# EAGLE design OpIoT_jetson_v_1_5 (EAGLE 9.6.2)
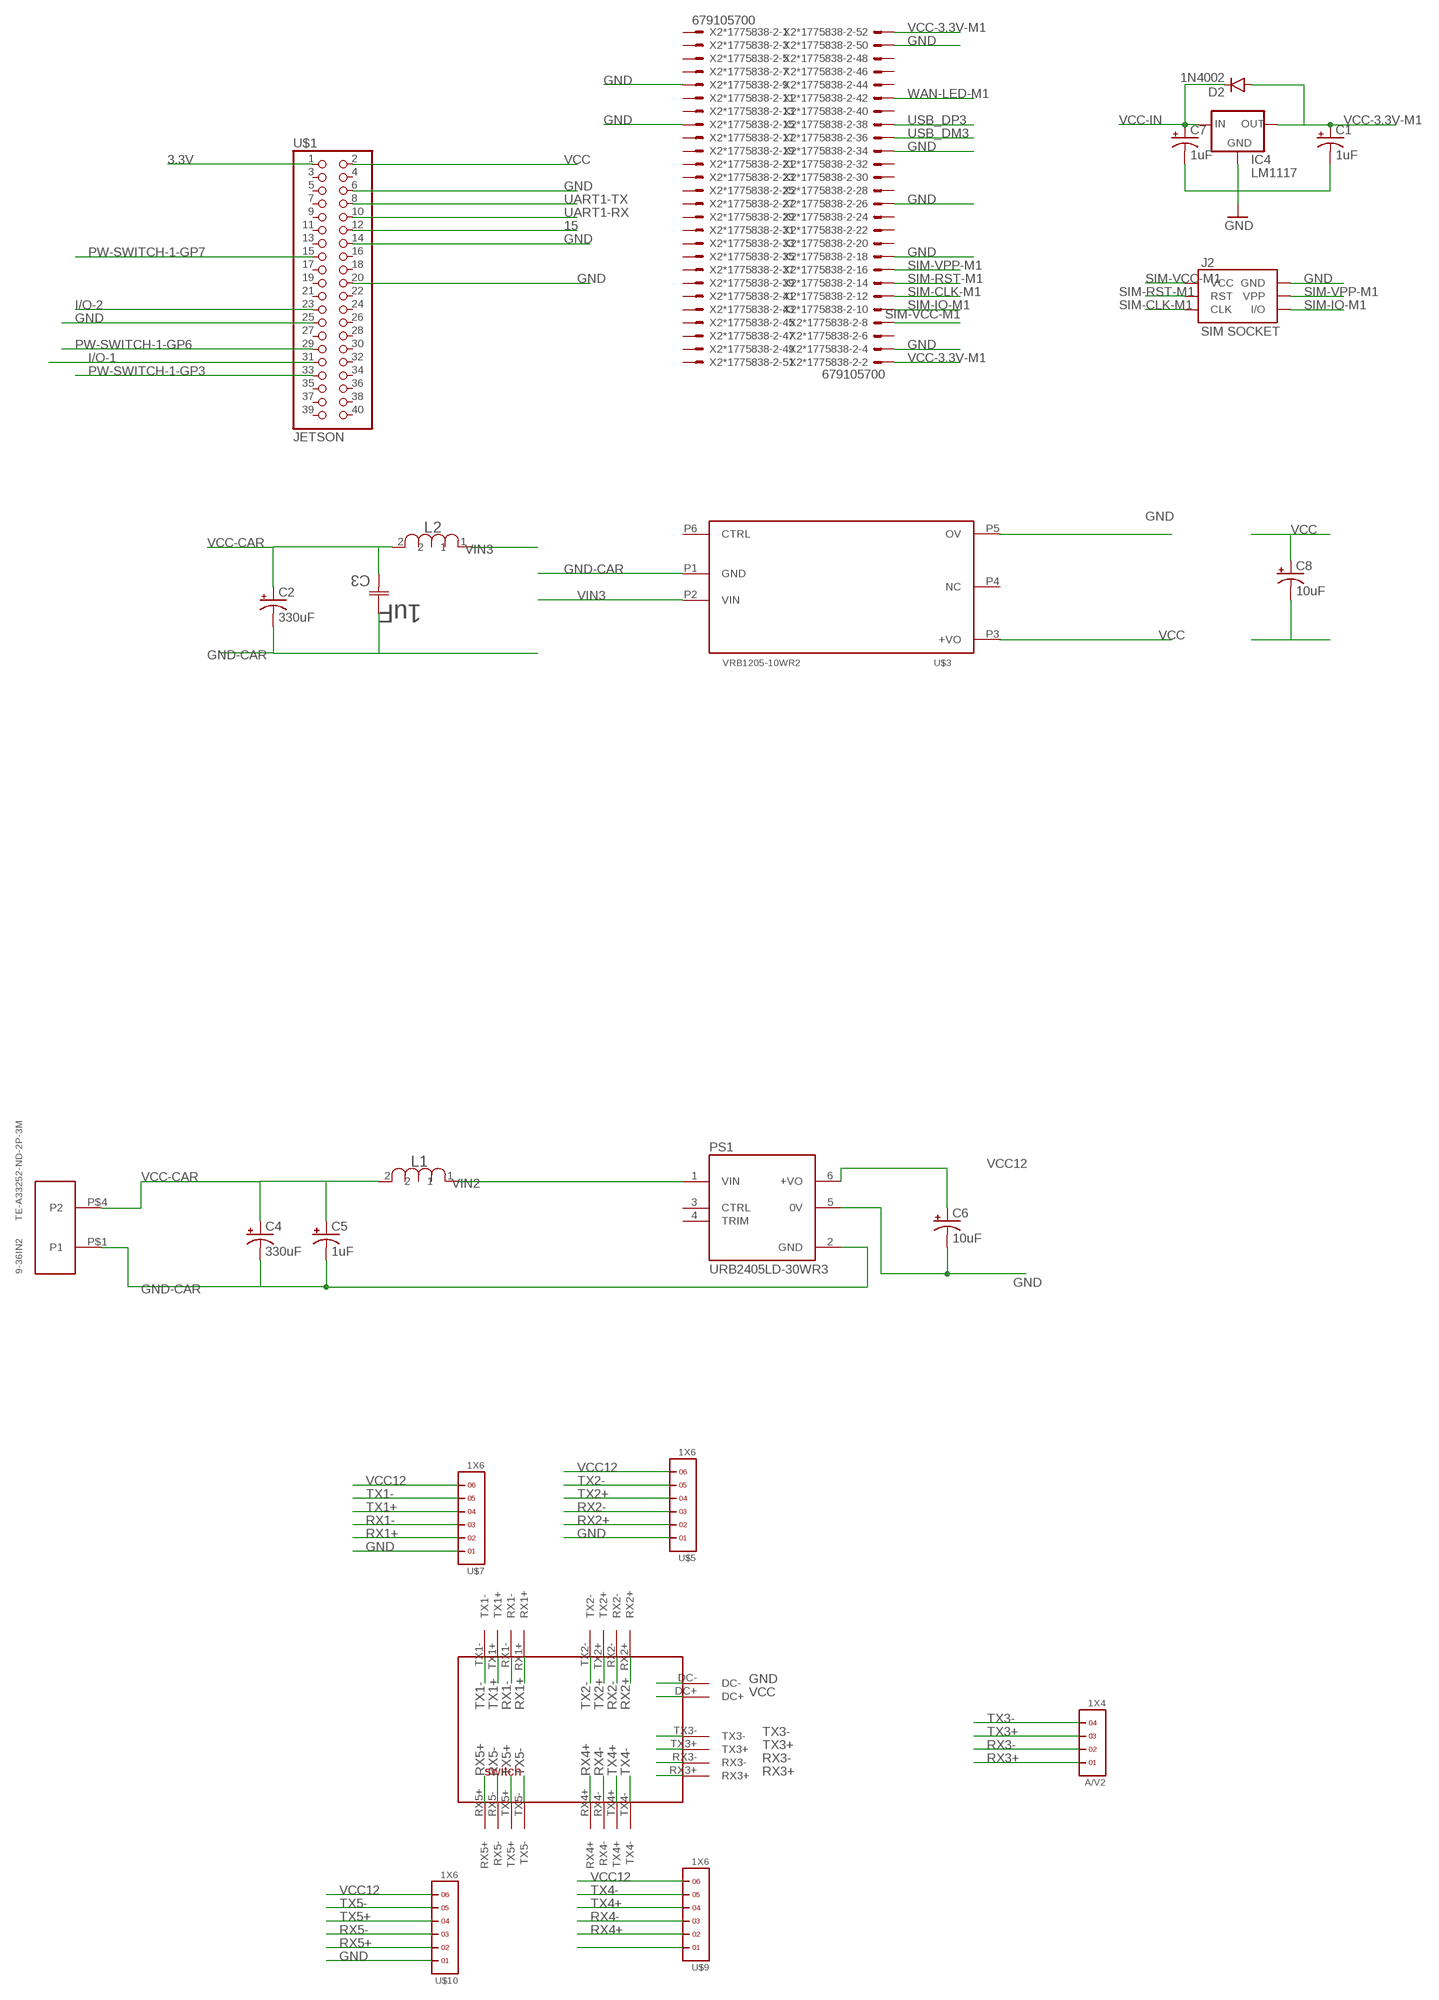
[diagram p0: schematic, sheet 1, part 1 of 3]
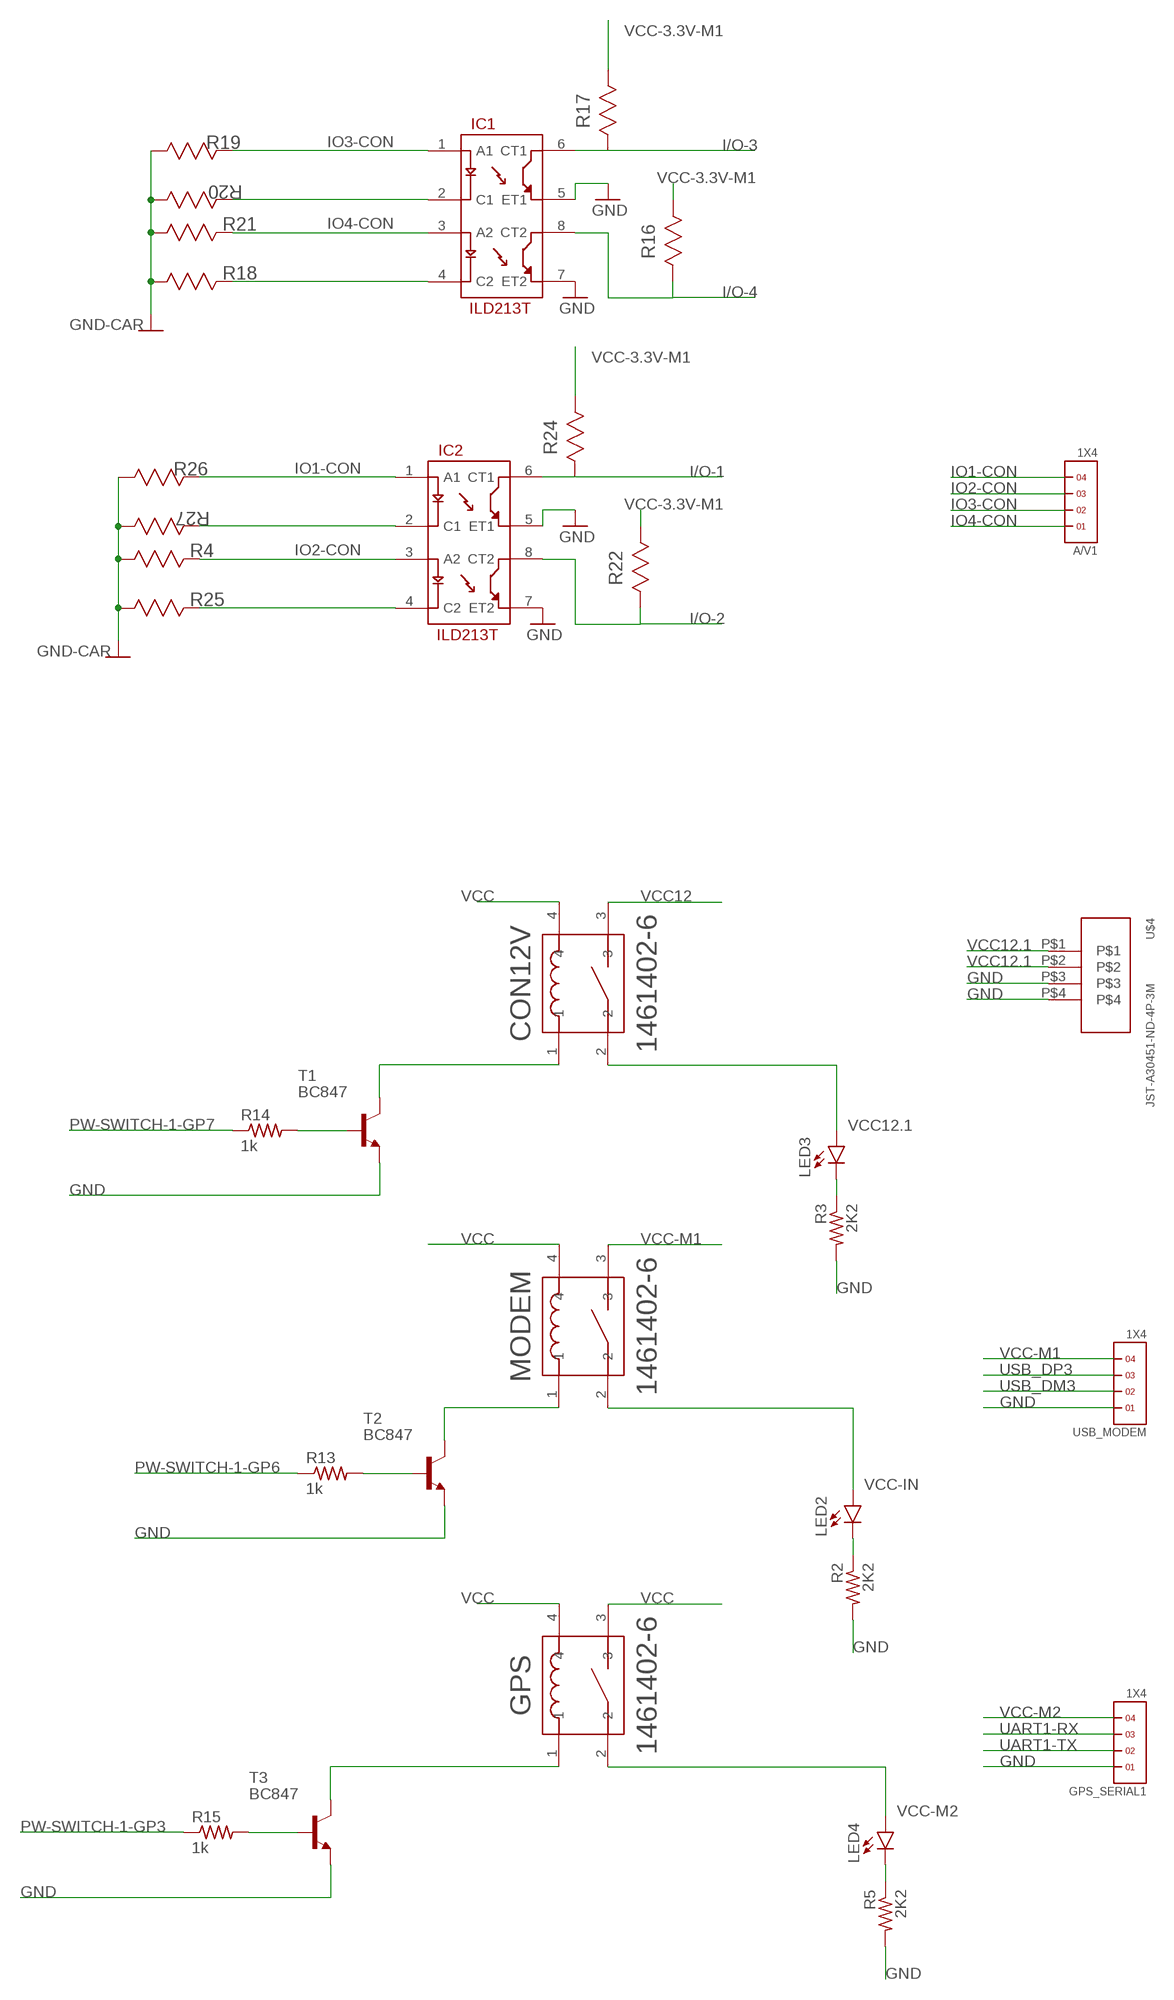
[diagram p1: schematic, sheet 1, part 2 of 3]
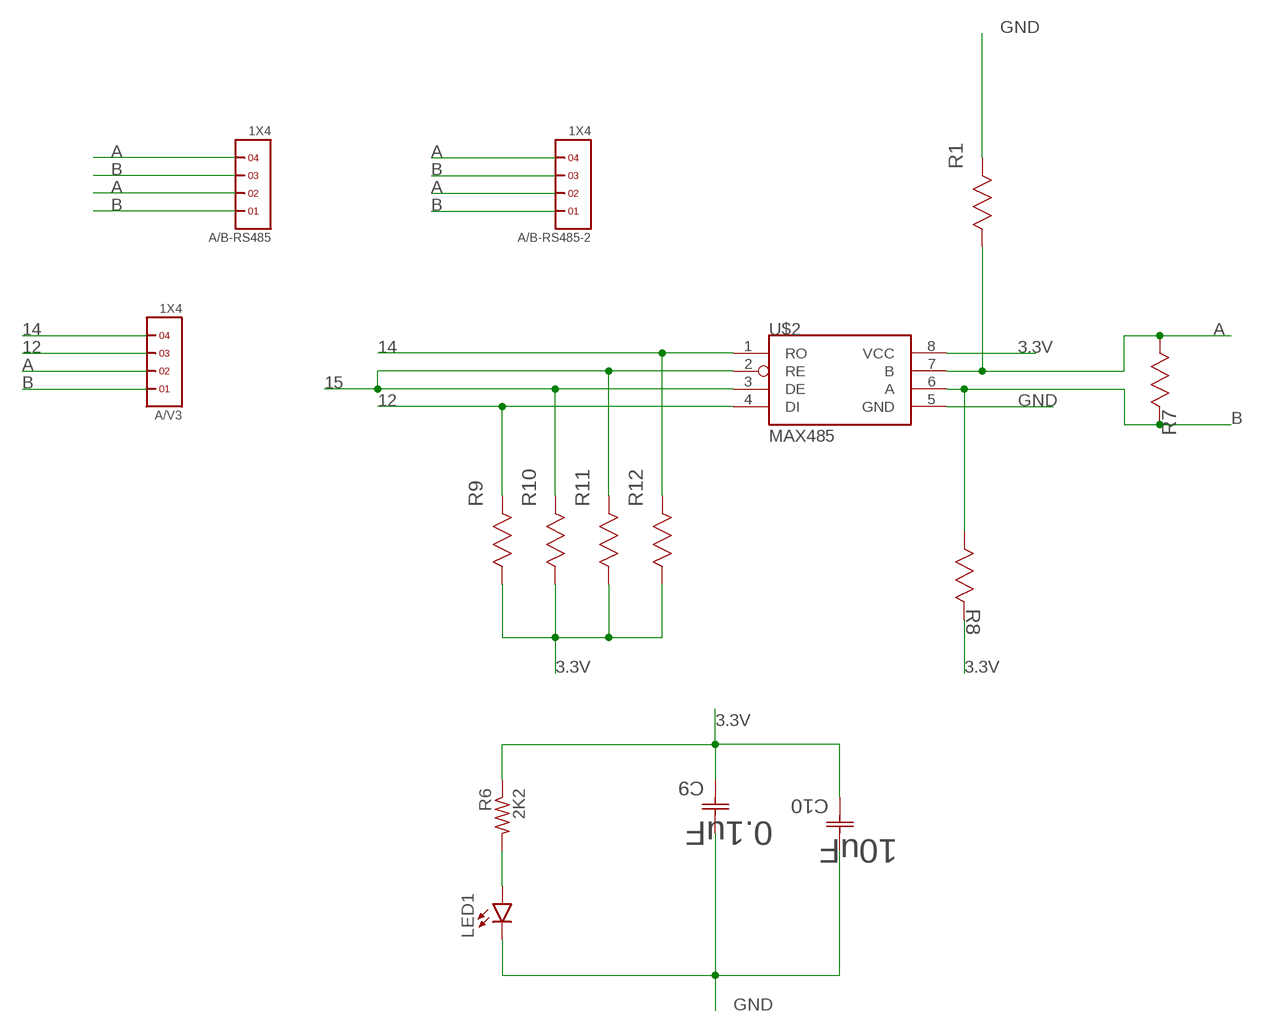
[diagram p2: schematic, sheet 1, part 3 of 3]

## Parts
9-36IN2  TE-A33252-ND-2P-3M  [TE-A33252-ND-2P-3M]
A/B-RS485  1X4  [1X4]
A/B-RS485-2  1X4  [1X4]
A/V1  1X4  [1X4]
A/V2  1X4  [1X4]
A/V3  1X4  [1X4]
C1  1uF  CAP_POL1206-KIT  [EIA3216-KIT]
C2  330uF  CPOL-USUD-10X10  [UD-10X10_NICHICON]
C3  1uF  C1206C105K5RACTU  [CAPC3216X110N]
C4  330uF  CPOL-USUD-10X10  [UD-10X10_NICHICON]
C5  1uF  CAP_POL1206-KIT  [EIA3216-KIT]
C6  10uF  CAP_POL1206-KIT  [EIA3216-KIT]
C7  1uF  CAP_POL1206-KIT  [EIA3216-KIT]
C8  10uF  CAP_POL1206-KIT  [EIA3216-KIT]
C9  0.1uF  C1206C105K5RACTU  [CAPC3216X110N]
C10  10uF  C1206C105K5RACTU  [CAPC3216X110N]
CON12V  1461402-6  [RELAY_1461402-6]
D2  1N4002  DIODESMA-KIT  [SMA-DIODE-KIT]
GPS  1461402-6  [RELAY_1461402-6]
GPS_SERIAL1  1X4  [1X4]
IC1  ILD213T  [SO08]
IC2  ILD213T  [SO08]
IC4  LM1117  [SOT223]
J2  SIM SOCKET  SIMHOLDERSIM  [SIMHOLDER]
L1  4.7uH  PM1210-1R0J-RC  [INDC3225X22N]
L2  4.7uH  PM1210-1R0J-RC  [INDC3225X22N]
LED1  LEDCHIPLED_1206  [CHIPLED_1206]
LED2  LEDCHIPLED_1206  [CHIPLED_1206]
LED3  LEDCHIPLED_1206  [CHIPLED_1206]
LED4  LEDCHIPLED_1206  [CHIPLED_1206]
MODEM  1461402-6  [RELAY_1461402-6]
PS1  URB2405LD-30WR3  [CONV_URB2405LD-30WR3]
R1  20K  ERJ-8ENF1501V  [RESC3216X71N]
R2  2K2  R-US_M1206  [M1206]
R3  2K2  R-US_M1206  [M1206]
R4  4K7  ERJ-8ENF1501V  [RESC3216X71N]
R5  2K2  R-US_M1206  [M1206]
R6  2K2  R-US_M1206  [M1206]
R7  120  ERJ-8ENF1501V  [RESC3216X71N]
R8  20k  ERJ-8ENF1501V  [RESC3216X71N]
R9  10k  ERJ-8ENF1501V  [RESC3216X71N]
R10  10k  ERJ-8ENF1501V  [RESC3216X71N]
R11  10k  ERJ-8ENF1501V  [RESC3216X71N]
R12  10k  ERJ-8ENF1501V  [RESC3216X71N]
R13  1k  R-US_M1406  [M1406]
R14  1k  R-US_M1406  [M1406]
R15  1k  R-US_M1406  [M1406]
R16  300K  ERJ-8ENF1501V  [RESC3216X71N]
R17  300K  ERJ-8ENF1501V  [RESC3216X71N]
R18  2.2K  ERJ-8ENF1501V  [RESC3216X71N]
R19  4K7  ERJ-8ENF1501V  [RESC3216X71N]
R20  2.2K  ERJ-8ENF1501V  [RESC3216X71N]
R21  4K7  ERJ-8ENF1501V  [RESC3216X71N]
R22  300K  ERJ-8ENF1501V  [RESC3216X71N]
R24  300K  ERJ-8ENF1501V  [RESC3216X71N]
R25  2.2K  ERJ-8ENF1501V  [RESC3216X71N]
R26  ERJ-8ENF1501V  [RESC3216X71N]
R27  2.2K  ERJ-8ENF1501V  [RESC3216X71N]
T1  BC847  [SOT23]
T2  BC847  [SOT23]
T3  BC847  [SOT23]
U$1  JETSON  [2X20]
U$2  MAX485  [SO08]
U$3  VRB1205-10WR2  [MORNSUN-5V]
U$4  JST-A30451-ND-4P-3M  [TE-A30451-4P-TH-3M]
U$5  1X6  [1X6]
U$6  SWITCH  [JP4]
U$7  1X6  [1X6]
U$9  1X6  [1X6]
U$10  1X6  [1X6]
USB_MODEM  1X4  [1X4]
X2*1775838-2  679105700  [679105700]

## Nets
3.3V: C9.2(C2) C10.2(C2) R6.1 R8.1(R1) R9.2(R2) R10.2(R2) R11.2(R2) R12.2(R2) U$1.1 U$2.8(VCC)
12: A/V3.3 R9.1(R1) U$2.4(DI)
14: A/V3.4 R12.1(R1) U$2.1(RO)
15: R10.1(R1) R11.1(R1) U$1.12 U$2.2(RE) U$2.3(DE)
A: A/B-RS485-2.2 A/B-RS485-2.4 A/B-RS485.2 A/B-RS485.4 A/V3.2 R1.2(R2) R7.1(R1) U$2.7(B)
B: A/B-RS485-2.1 A/B-RS485-2.3 A/B-RS485.1 A/B-RS485.3 A/V3.1 R7.2(R2) R8.2(R2) U$2.6(A)
GND: C1.C(-) C6.C(-) C7.C(-) C8.C(-) C9.1(C1) C10.1(C1) GPS_SERIAL1.1 IC1.5(ET1) IC1.7(ET2) IC2.5(ET1) IC2.7(ET2) IC4.1(GND) J2.C5(GND) LED1.C PS1.5(0V) R1.1(R1) R2.2 R3.2 R5.2 T1.2(E) T2.2(E) T3.2(E) U$1.6 U$1.14 U$1.20 U$1.25 U$2.5(GND) U$3.P5(OV) U$4.P$3 U$4.P$4 U$5.1 U$6.DC- U$7.1 U$9.1 U$10.1 USB_MODEM.1 X2*1775838-2.4 X2*1775838-2.9 X2*1775838-2.15 X2*1775838-2.18 X2*1775838-2.26 X2*1775838-2.34 X2*1775838-2.50
GND-CAR: 9-36IN2.P$1(P1) C2.- C3.1(C1) C4.- C5.C(-) PS1.2(GND) R4.2(R2) R18.1(R1) R19.2(R2) R20.1(R1) R21.2(R2) R25.1(R1) R26.2(R2) R27.1(R1) U$3.P1(GND)
GPIO1: CON12V.1 T1.3(C)
GPIO2: GPS.1 T3.3(C)
GPIO16: MODEM.1 T2.3(C)
I/O-1: IC2.6(CT1) R24.2(R2) U$1.31
I/O-2: IC2.8(CT2) R22.2(R2) U$1.23
I/O-3: IC1.6(CT1) R17.2(R2)
I/O-4: IC1.8(CT2) R16.2(R2)
IO1-CON: A/V1.4 IC2.1(A1) R26.1(R1)
IO2-CON: A/V1.3 IC2.3(A2) R4.1(R1)
IO3-CON: A/V1.2 IC1.1(A1) R19.1(R1)
IO4-CON: A/V1.1 IC1.3(A2) R21.1(R1)
N$2: LED1.A R6.2
N$3: LED2.C R2.1
N$4: LED3.C R3.1
N$5: LED4.C R5.1
N$6: R13.2 T2.1(B)
N$7: IC2.2(C1) R27.2(R2)
N$8: R14.2 T1.1(B)
N$9: IC2.4(C2) R25.2(R2)
N$10: R15.2 T3.1(B)
N$11: IC1.2(C1) R20.2(R2)
N$15: IC1.4(C2) R18.2(R2)
PW-SWITCH-1-GP3: R15.1 U$1.33
PW-SWITCH-1-GP6: R13.1 U$1.29
PW-SWITCH-1-GP7: R14.1 U$1.15
RX1+: U$6.RX1+ U$7.2
RX1-: U$6.RX1- U$7.3
RX2+: U$5.2 U$6.RX2+
RX2-: U$5.3 U$6.RX2-
RX3+: A/V2.1 U$6.RX3+
RX3-: A/V2.2 U$6.RX3-
RX4+: U$6.RX4+ U$9.2
RX4-: U$6.RX4- U$9.3
RX5+: U$6.RX5+ U$10.2
RX5-: U$6.RX5- U$10.3
SIM-CLK-M1: J2.C3(CLK) X2*1775838-2.12
SIM-IO-M1: J2.C7(I/O) X2*1775838-2.10
SIM-RST-M1: J2.C2(RST) X2*1775838-2.14
SIM-VCC-M1: J2.C1(VCC) X2*1775838-2.8
SIM-VPP-M1: J2.C6(VPP) X2*1775838-2.16
TX1+: U$6.TX1+ U$7.4
TX1-: U$6.TX1- U$7.5
TX2+: U$5.4 U$6.TX2+
TX2-: U$5.5 U$6.TX2-
TX3+: A/V2.3 U$6.TX3+
TX3-: A/V2.4 U$6.TX3-
TX4+: U$6.TX4+ U$9.4
TX4-: U$6.TX4- U$9.5
TX5+: U$6.TX5+ U$10.4
TX5-: U$6.TX5- U$10.5
UART1-RX: GPS_SERIAL1.3 U$1.10
UART1-TX: GPS_SERIAL1.2 U$1.8
USB_DM3: USB_MODEM.2 X2*1775838-2.36
USB_DP3: USB_MODEM.3 X2*1775838-2.38
VCC: C8.A(+) CON12V.4 GPS.3 GPS.4 MODEM.4 U$1.2 U$3.P3(+VO) U$6.DC+
VCC12: C6.A(+) CON12V.3 PS1.6(+VO) U$5.6 U$7.6 U$9.6 U$10.6
VCC12.1: CON12V.2 LED3.A U$4.P$1 U$4.P$2
VCC-3.3V-M1: C1.A(+) D2.A IC4.2(OUT) R16.1(R1) R17.1(R1) R22.1(R1) R24.1(R1) X2*1775838-2.2 X2*1775838-2.52
VCC-CAR: 9-36IN2.P$4(P2) C2.+ C3.2(C2) C4.+ C5.A(+) L1.2 L2.2
VCC-IN: C7.A(+) D2.C IC4.3(IN) LED2.A MODEM.2
VCC-M1: MODEM.3 USB_MODEM.4
VCC-M2: GPS.2 GPS_SERIAL1.4 LED4.A
VIN2: L1.1 PS1.1(VIN)
VIN3: L2.1 U$3.P2(VIN)
WAN-LED-M1: X2*1775838-2.42
Unconnected: PS1.3(CTRL) PS1.4(TRIM) U$1.3 U$1.4 U$1.5 U$1.7 U$1.9 U$1.11 U$1.13 U$1.16 U$1.17 U$1.18 U$1.19 U$1.21 U$1.22 U$1.24 U$1.26 U$1.27 U$1.28 U$1.30 U$1.32 U$1.34 U$1.35 U$1.36 U$1.37 U$1.38 U$1.39 U$1.40 U$3.P4(NC) U$3.P6(CTRL) X2*1775838-2.1 X2*1775838-2.3 X2*1775838-2.5 X2*1775838-2.6 X2*1775838-2.7 X2*1775838-2.11 X2*1775838-2.13 X2*1775838-2.17 X2*1775838-2.19 X2*1775838-2.20 X2*1775838-2.21 X2*1775838-2.22 X2*1775838-2.23 X2*1775838-2.24 X2*1775838-2.25 X2*1775838-2.27 X2*1775838-2.28 X2*1775838-2.29 X2*1775838-2.30 X2*1775838-2.31 X2*1775838-2.32 X2*1775838-2.33 X2*1775838-2.35 X2*1775838-2.37 X2*1775838-2.39 X2*1775838-2.40 X2*1775838-2.41 X2*1775838-2.43 X2*1775838-2.44 X2*1775838-2.45 X2*1775838-2.46 X2*1775838-2.47 X2*1775838-2.48 X2*1775838-2.49 X2*1775838-2.51

## Library data of the parts
9-36IN2 = MonkeyTech:TE-A33252-ND-2P-3M
A/B-RS485 A/B-RS485-2 A/V1-A/V3 GPS_SERIAL1 USB_MODEM = headers(2mm):1X4
C1 C5-C8 = SparkFun-Passives:CAP_POL: Capacitor Polarized These are standard SMD and PTH capacitors. Normally 10uF, 47uF, and 100uF in electrolytic and tantalum varieties. Always verify the external diameter of the through hole cap, it varies with capacity, voltage, and manufacturer. The EIA devices should be standard.
C2 C4 = rcl:CPOL-US: POLARIZED CAPACITOR, American symbol; SPICEPREFIX: C
C3 = Kemet_By_element14_Batch_1:C1206C105K5RACTU: CAPACITOR, 1206; MPN: C1206C105K5RACTU; OC_FARNELL: 1288207; OC_NEWARK: 93K6006; SUPPLIER: Kemet; TOLERANCE: ±10%; VOLTAGERATING: 50V
C9 C10 = Kemet_By_element14_Batch_1:C1206C105K5RACTU: CAPACITOR, 1206; MPN: C1206C105K5RACTU; OC_FARNELL: 1288207; OC_NEWARK: 93K6006; SUPPLIER: Kemet; TOLERANCE: ±10%; VALUE: 1uF; VOLTAGERATING: 50V
CON12V GPS MODEM = 1461402-6:1461402-6: Electromechanical Relay 12VDC 320Ohm 10A SPST-NO (( 18.2mm 10.2mm 14.7mm)) THT Industrial Relay Check prices <https://pricing.snapeda.com/search/part/OJE-SH-112HM%2C000/?ref=eda>; AVAILABILITY: Warning; COMMENT: 1461402-6; DESCRIPTION: Electromechanical Relay 12VDC 320Ohm 10A SPST-NO (( 18.2mm 10.2mm 14.7mm)) THT Industrial Relay; MF: TE Connectivity; MP: OJE-SH-112HM,000; PACKAGE: None; PRICE: None; PURCHASE-URL: https://pricing.snapeda.com/search/part/OJE-SH-112HM,000/?ref=eda
D2 = SparkFun-DiscreteSemi:DIODE: Diode These are standard reverse protection diodes and small signal diodes. SMA package can handle up to about 1A. SOD-323 can handle about 200mA. What the SOD-323 package when ordering, there are some mfgs out there that are 5-pin packages.
IC1 IC2 = SparkFun-DiscreteSemi:ILD213T: Dual optoisolator.
IC4 = LM1117:LM1117; AVAILABILITY: Good; DESCRIPTION: Voltage stabiliser; LDO, fixed; 3.3V; 0.8A; SOT223; SMD; MF: Texas Instruments; MP: LM1117MP-3.3/NOPB; PACKAGE: SOT-223 Texas Instruments; PRICE: 0.61 USD
J2 = SparkFun-Connectors:SIMHOLDER: SIM Socket Socket for SIM cellular cards. Schematic element and footprint production proven. Spark Fun Electronics SKU : PRT-00548; PROD_ID: CONN-08536
L1 L2 = Bourns_By_element14_Batch_1:PM1210-1R0J-RC: CHIP INDUCTOR, 1UH, 400MA 5% 120MHZ; MPN: PM1210-1R0J-RC; OC_FARNELL: 1180462; OC_NEWARK: 63K3090; SUPPLIER: BOURNS; TOLERANCE: ±5 %; VALUE: 1.0 uH
LED1-LED4 = led:LED: LED OSRAM: - CHIPLED LG R971, LG N971, LY N971, LG Q971, LY Q971, LO R971, LY R971 LH N974, LH R974 LS Q976, LO Q976, LY Q976 LO Q996 - Hyper CHIPLED LW Q18S LB Q993, LB Q99A, LB R99A - SideLED LS A670, LO A670, LY A670, LG A670, LP A670 LB A673, LV A673, LT A673, LW A673 LH A674 LY A675 LS A676, LA A676, LO A676, LY A676, LW A676 LS A679, LY A679, LG A679 - Hyper Micro SIDELED® LS Y876, LA Y876, LO Y876, LY Y876 LT Y87S - SmartLED LW L88C, LW L88S LB L89C, LB L89S, LG L890 LS L89K, LO L89K, LY L89K LS L896, LA L896, LO L896, LY L896 - TOPLED LS T670, LO T670, LY T670, LG T670, LP T670 LSG T670, LSP T670, LSY T670, LOP T670, LYG T670 LG T671, LOG T671, LSG T671 LB T673, LV T673, LT T673, LW T673 LH T674 LS T676, LA T676, LO T676, LY T676, LB T676, LH T676, LSB T676, LW T676 LB T67C, LV T67C, LT T67C, LS T67K, LO T67K, LY T67K, LW E67C LS E67B, LA E67B, LO E67B, LY E67B, LB E67C, LV E67C, LT E67C LW T67C LS T679, LY T679, LG T679 LS T770, LO T770, LY T770, LG T770, LP T770 LB T773, LV T773, LT T773, LW T773 LH T774 LS E675, LA E675, LY E675, LS T675 LS T776, LA T776, LO T776, LY T776, LB T776 LHGB T686 LT T68C, LB T68C - Hyper Mini TOPLED® LB M676 - Mini TOPLED Santana® LG M470 LS M47K, LO M47K, LY M47K Source: http://www.osram.convergy.de LUXEON: - LUMILED® LXK2-PW12-R00, LXK2-PW12-S00, LXK2-PW14-U00, LXK2-PW14-V00 LXK2-PM12-R00, LXK2-PM12-S00, LXK2-PM14-U00 LXK2-PE12-Q00, LXK2-PE12-R00, LXK2-PE12-S00, LXK2-PE14-T00, LXK2-PE14-U00 LXK2-PB12-K00, LXK2-PB12-L00, LXK2-PB12-M00, LXK2-PB14-N00, LXK2-PB14-P00, LXK2-PB14-Q00 LXK2-PR12-L00, LXK2-PR12-M00, LXK2-PR14-Q00, LXK2-PR14-R00 LXK2-PD12-Q00, LXK2-PD12-R00, LXK2-PD12-S00 LXK2-PH12-R00, LXK2-PH12-S00 LXK2-PL12-P00, LXK2-PL12-Q00, LXK2-PL12-R00 Source: www.luxeon.com KINGBRIGHT: KA-3528ASYC Source: www.kingbright.com
PS1 = URB2405LD-30WR3:URB2405LD-30WR3: URB_LD-30WR3 series are isolated 30W DC-DC products with 4:1 input voltage; AVAILABILITY: Unavailable; DESCRIPTION: URB_LD-30WR3 series are isolated 30W DC-DC products with 4:1 input voltage; MF: MORNSUN; MP: URB2405LD-30WR3; PACKAGE: Package; PRICE: None
R1 R4 R7-R12 R16-R22 R24-R27 = Panasonic_By_element14_Batch_1:ERJ-8ENF1501V: RESISTOR, 1206; MPN: ERJ-8ENF1501V; OC_FARNELL: 1748434; OC_NEWARK: 64R5441; SUPPLIER: Panasonic; TOLERANCE: ±1 %; VALUE: 1.5 KOhm; WATTAGE: 0.25 W
R2 R3 R5 R6 R13-R15 = rcl:R-US_: RESISTOR, American symbol; SPICEPREFIX: R
T1-T3 = transistor:BC847: NPN TRANSISTOR
U$1 = Jetson:JETSON
U$2 = MAX485:MAX485; AVAILABILITY: Unavailable; DESCRIPTION: 1/1 Transceiver Half RS422, RS485 8-uMAX; MF: Maxim Integrated; MP: MAX485; PACKAGE: SOIC-8 Maxim Integrated; PRICE: None
U$3 = MonkeyTech:VRB1205-10WR2
U$4 = MonkeyTech:JST-A30451-ND-4P-3M
U$5 U$7 U$9 U$10 = headers(2mm):1X6
U$6 = switch2:SWITCH
X2*1775838-2 = con-molex:679105700: MINI PCI EXPRESS CONNECTOR 0.8MM PITCH, 52 CIRCUIT Source: http://www.molex.com/pdm_docs/sd/679105700_sd.pdf; MF: MOLEX; MPN: 67910-5700; OC_FARNELL: unknown; OC_NEWARK: 93M2128

## Net classes
1 power: width 0.305 mm

## Board
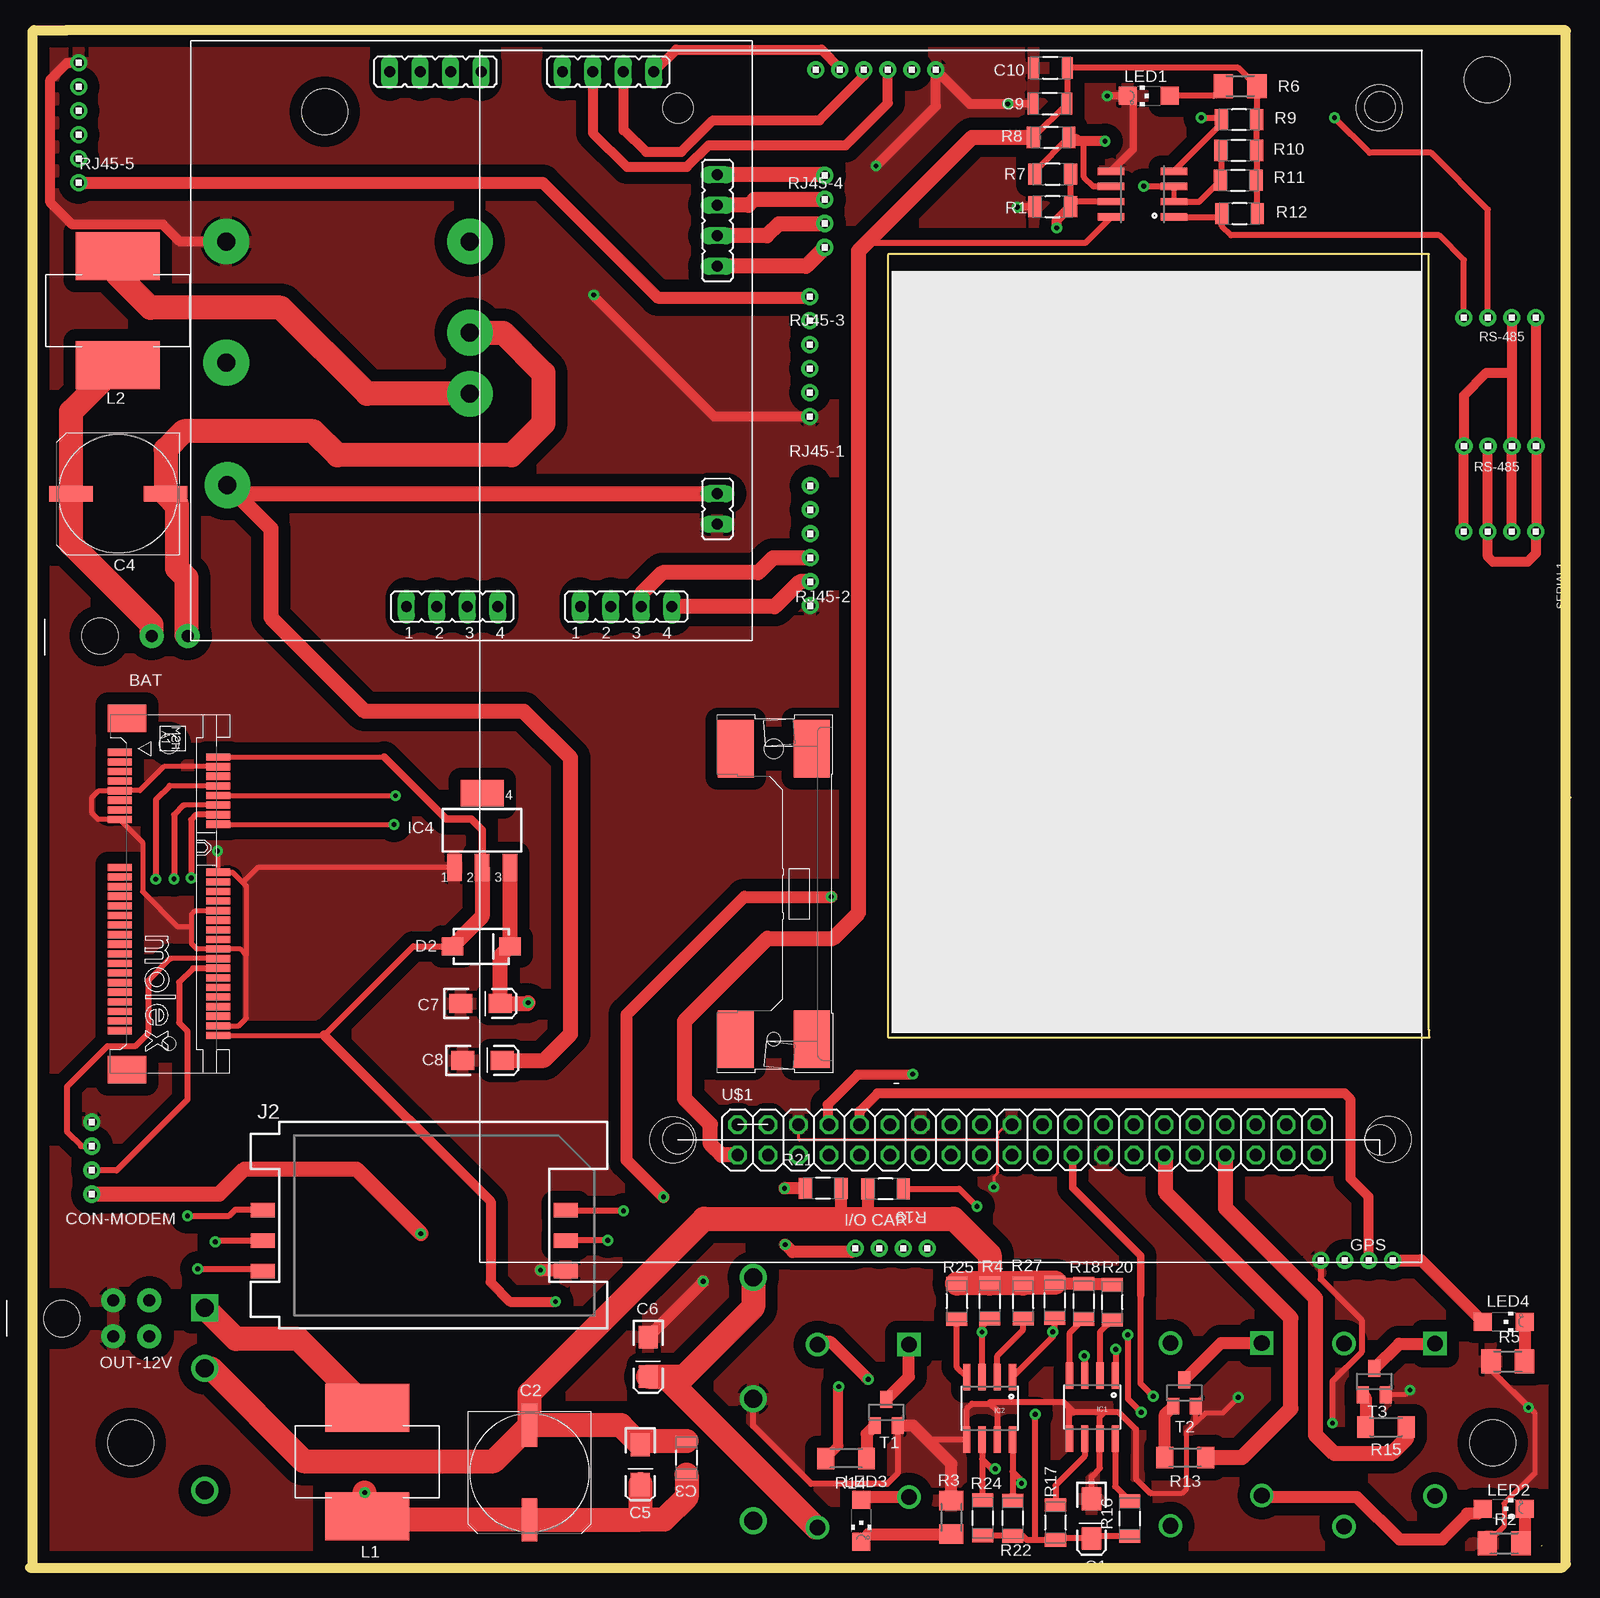
[diagram p3: board, top side]
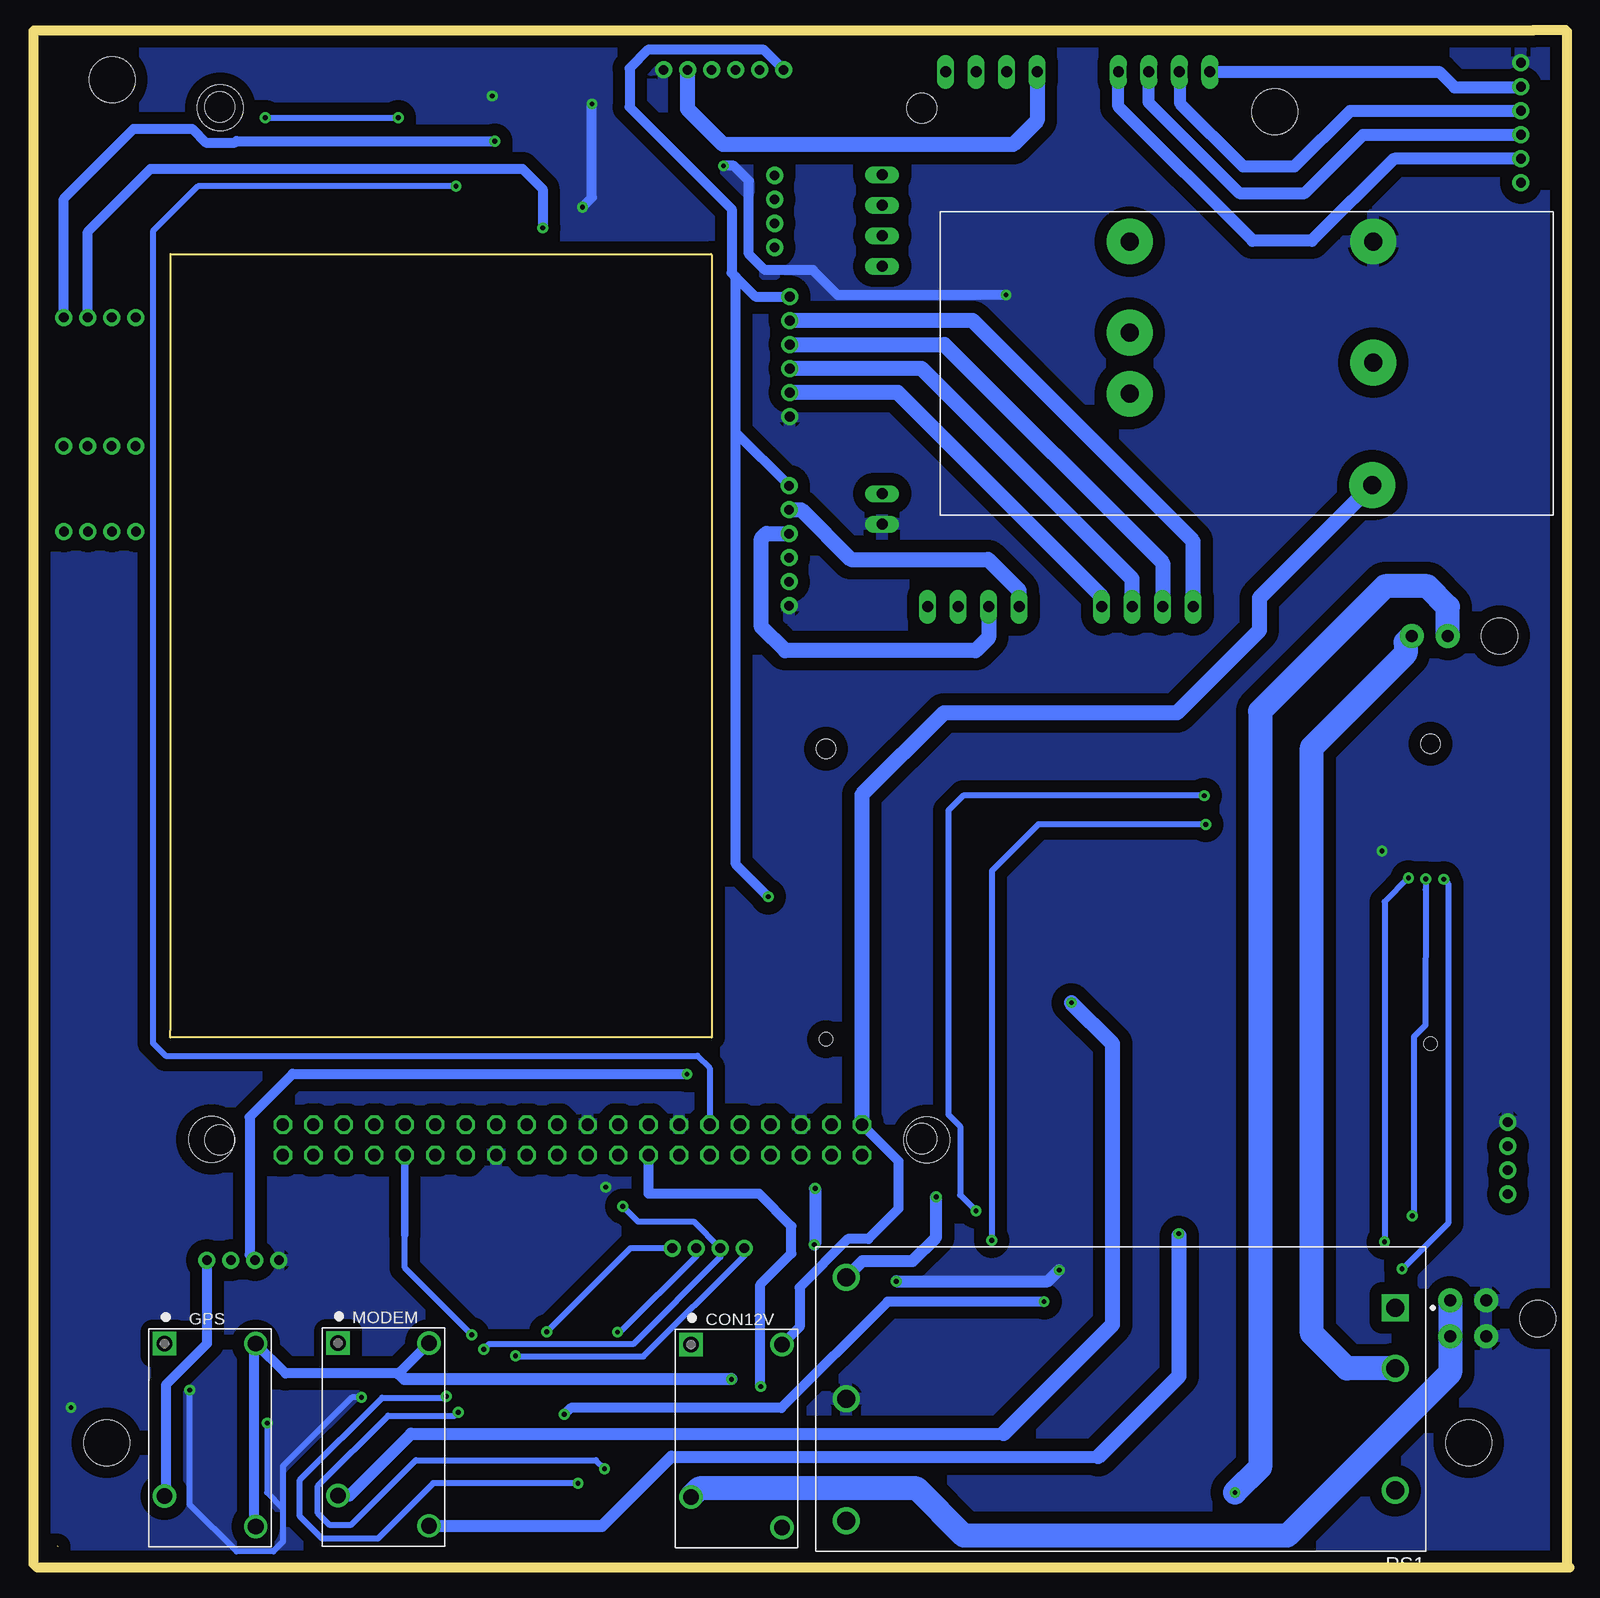
[diagram p4: board, bottom side, seen from below]

Size 128.3 x 128.18 mm. Coordinates in mm from the lower left corner, seen from the top.
Outline: 128.3,64.19 128.12,64.37
Outline: 116.58,44.81 116.58,109.48 116.6,109.5 71.56,109.5 71.49,109.42 71.49,44.23 71.52,44.2 116.61,44.2 116.64,44.23 116.6,44.27 116.6,44.8
Outline: 126.01,1.84 125.94,1.77
Outline: 0,0 127.69,0 128,0.3 128,128.11 127.96,128.15 3.04,128.15 3.02,128.16
Outline: 0.21,0 0.21,128.05 0.35,128.18 3.05,128.18
Copper layers (1*16): Top 0.035mm / dielectric 1.6mm / Bottom 0.035mm
Design rules "Check_Rule_Microcircuitos": minimum track width 0.25mm, minimum drill 0.4mm, track to track 0.25mm, track to pad 0.25mm, pad to pad 0.25mm, via to via 0.25mm, smd to smd 0mil, copper to edge 0.6mm, drill to drill 0.4mm, minimum pad ring 0.25mm, minimum via ring 0.25mm, stop-mask expansion 0mil, vias tented up to drill 0.4mm, thermal gap 0.25mm
Holes 3.81 mm at 121.9,10.41 8.39,10.41 24.57,121.38 121.45,124.05 113.17,35.7 53.56,35.66 112.44,121.7

### Footprints (pad centres in the part's own frame; a part is rotated, then mirrored left to right if it is on the bottom)
TE-A33252-ND-2P-3M = drill 1 pad 2: P$1 -0.23,-1.14; P$4 -0.23,-4.14 | hole 3: -0.23,-8.44
1X4 = drill 0.8 pad 1.422: 1 -3,0; 2 -1,0; 3 1,0; 4 3,0
EIA3216-KIT = smd 1.9 x 1.6: A 1.65,0; C -1.65,0
UD-10X10_NICHICON = smd 3.6 x 1.3: + 3.925,0; - -3.95,0
CAPC3216X110N = smd 0.914 x 1.803: 1 -1.397,0; 2 1.397,0
RELAY_1461402-6 = drill 1.3 square: 1 -7.62,-3.8 | drill 1.3: 2 5.08,-3.8; 3 7.62,3.8; 4 -7.62,3.8
SMA-DIODE-KIT = smd 1.77 x 1.47: A -2.4,0; C 2.4,0
SO08 = smd 0.61 x 2.21: 1 -1.905,-2.616; 2 -0.635,-2.616; 3 0.635,-2.616; 4 1.905,-2.616; 5 1.905,2.616; 6 0.635,2.616; 7 -0.635,2.616; 8 -1.905,2.616
SOT223 = smd 1.219 x 2.235: 1 -2.311,-3.099; 2 0,-3.099; 3 2.311,-3.099 | smd 3.6 x 2.2: 4 0,3.099
SIMHOLDER = smd 2 x 1.2: C1 -12.61,-3.81; C2 -12.61,-1.27; C3 -12.61,1.27; C5 12.61,-3.81; C6 12.61,-1.27; C7 12.61,1.27
INDC3225X22N = smd 4 x 7: 1 -0.524,0; 2 8.524,0
CHIPLED_1206 = smd 1.5 x 1.5: A 0,-1.75; C 0,1.75
CONV_URB2405LD-30WR3 = drill 1.5 square: 1 -22.86,-7.62 | drill 1.5: 2 -22.86,-2.54; 3 -22.86,7.62; 4 22.86,10.16; 5 22.86,0; 6 22.86,-10.16
RESC3216X71N = smd 1.118 x 1.753: 1 -1.473,0; 2 1.473,0
M1206 = smd 1.6 x 2: 1 -1.4,0; 2 1.4,0
M1406 = smd 1.4 x 1.8: 1 -1.7,0; 2 1.7,0
SOT23 = smd 1 x 1.4: 1 -0.95,-1.1; 2 0.95,-1.1; 3 0,1.1
2X20 = drill 1.016 octagon: 1 -28.53,0.93; 2 -28.53,3.47; 3 -25.99,0.93; 4 -25.99,3.47; 5 -23.45,0.93; 6 -23.45,3.47; 7 -20.91,0.93; 8 -20.91,3.47; 9 -18.37,0.93; 10 -18.37,3.47; 11 -15.83,0.93; 12 -15.83,3.47; 13 -13.29,0.93; 14 -13.29,3.47; 15 -10.75,0.93; 16 -10.75,3.47; 17 -8.21,0.93; 18 -8.21,3.47; 19 -5.67,0.93; 20 -5.67,3.47; 21 -3.13,0.93; 22 -3.13,3.47; 23 -0.59,0.93; 24 -0.59,3.47; 25 1.95,0.93; 26 1.95,3.47; 27 4.49,0.93; 28 4.49,3.47; 29 7.03,0.93; 30 7.03,3.47; 31 9.57,0.93; 32 9.57,3.47; 33 12.11,0.93; 34 12.11,3.47; 35 14.65,0.93; 36 14.65,3.47; 37 17.19,0.93; 38 17.19,3.47; 39 19.73,0.93; 40 19.73,3.47 | hole 2.5: 25,2.2; -33.5,2.3; -33.5,2.3; 25,88.3; -33.5,88.2
MORNSUN-5V = drill 1.5 pad 3.81: P1 -10.4,2.3; P2 -10.4,-2.8; P3 9.8,-10.4; P4 9.9,-0.2; P5 9.9,9.9; P6 -10.4,9.9
TE-A30451-4P-TH-3M = drill 1 pad 2: P$1 -1.5,-1.3; P$2 1.5,-1.3; P$3 1.5,-4.3; P$4 -1.5,-4.3 | hole 3: 0,-8.6
1X6 = drill 0.8 pad 1.422: 1 -5,0; 2 -3,0; 3 -1,0; 4 1,0; 5 3,0; 6 5,0
JP4 = drill 0.914 long: DC+ 24.3,9.43; DC- 24.3,6.89; RX1+ 6.01,0; RX1- 3.47,0; RX2+ 20.51,0; RX2- 17.97,0; RX3+ 24.3,28.39; RX3- 24.3,30.93; RX4+ 11.39,44.6; RX4- 13.93,44.6; RX5+ -3.01,44.6; RX5- -0.47,44.6; TX1+ 0.93,0; TX1- -1.61,0; TX2+ 15.43,0; TX2- 12.89,0; TX3+ 24.3,33.47; TX3- 24.3,36.01; TX4+ 16.47,44.6; TX4- 19.01,44.6; TX5+ 2.07,44.6; TX5- 4.61,44.6
679105700 = smd 0.6 x 2: 1 0.7,-4.1; 2 1.1,4.1; 3 1.5,-4.1; 4 1.9,4.1; 5 2.3,-4.1; 6 2.7,4.1; 7 3.1,-4.1; 8 3.5,4.1; 9 3.9,-4.1; 10 4.3,4.1; 11 4.7,-4.1; 12 5.1,4.1; 13 5.5,-4.1; 14 5.9,4.1; 15 6.3,-4.1; 16 6.7,4.1; 17 10.3,-4.1; 18 10.7,4.1; 19 11.1,-4.1; 20 11.5,4.1; 21 11.9,-4.1; 22 12.3,4.1; 23 12.7,-4.1; 24 13.1,4.1; 25 13.5,-4.1; 26 13.9,4.1; 27 14.3,-4.1; 28 14.7,4.1; 29 15.1,-4.1; 30 15.5,4.1; 31 15.9,-4.1; 32 16.3,4.1; 33 16.7,-4.1; 34 17.1,4.1; 35 17.5,-4.1; 36 17.9,4.1; 37 18.3,-4.1; 38 18.7,4.1; 39 19.1,-4.1; 40 19.5,4.1; 41 19.9,-4.1; 42 20.3,4.1; 43 20.7,-4.1; 44 21.1,4.1; 45 21.5,-4.1; 46 21.9,4.1; 47 22.3,-4.1; 48 22.7,4.1; 49 23.1,-4.1; 50 23.5,4.1; 51 23.9,-4.1; 52 24.3,4.1 | smd 2.3 x 3.2: M1 27.15,-3.5; M2 -2.15,-3.5 | smd 4.8 x 3: M3 0.4,47.25; M4 0.4,53.55; M5 24.6,47.25; M6 24.6,53.55 | hole 1.6: 0,0; 0.4,50.4 | hole 1.1: 25,0; 24.6,50.4

### Placement (x,y rotation side)
9-36IN2  14.28,77.44 270 top
A/B-RS485  122.5,93.5 180 top
A/B-RS485-2  122.48,86.37 180 top
A/V1  71.78,26.62 0 top
A/V2  66.24,113.06 90 top
A/V3  122.49,104.21 180 top
C1  88.46,4.09 270 top
C2  41.63,7.93 270 top
C3  54.71,9.15 270 top
C4  7.35,89.53 180 top
C5  50.86,8.61 270 top
C6  51.51,17.57 270 top
C7  37.54,47.03 0 top
C8  37.71,42.3 0 top
C9  84.98,122.03 0 top
C10  85.03,125.03 0 top
CON12V  69.43,10.99 270 bottom
D2  37.6,51.79 0 top
GPS  113.29,11.06 270 bottom
GPS_SERIAL1  110.56,25.64 0 top
IC1  88.52,13.4 180 top
IC2  79.97,13.28 180 top
IC4  37.68,61.47 0 top
J2  32.02,28.55 0 top
L1  28.1,12.81 270 top
L2  7.31,108.78 270 top
LED1  93.24,122.69 90 top
LED2  122.83,4.92 270 top
LED3  69.27,3.93 180 top
LED4  122.82,20.49 270 top
MODEM  98.84,11.11 270 bottom
PS1  37.41,14.06 180 bottom
R1  85.22,113.45 0 top
R2  122.85,2.04 180 top
R3  76.78,4.2 90 top
R4  79.98,22.24 90 top
R5  123.14,17.19 180 top
R6  100.84,123.5 180 top
R7  85.22,116.16 180 top
R8  85.09,119.22 0 top
R9  100.75,120.71 0 top
R10  100.72,118.14 0 top
R11  100.68,115.64 0 top
R12  100.79,112.88 0 top
R13  96.27,9.2 180 top
R14  68.01,9.11 0 top
R15  112.99,11.73 180 top
R16  91.65,4.09 90 top
R17  85.46,3.77 90 top
R18  87.82,22.21 270 top
R19  71.3,31.59 180 top
R20  90.18,22.13 270 top
R21  66.1,31.64 0 top
R22  81.89,4.12 90 top
R24  79.39,4.16 90 top
R25  77.24,22.21 270 top
R26  85.4,22.29 90 top
R27  82.76,22.22 270 top
T1  71.35,12.95 0 top
T2  96.2,14.57 0 top
T3  112.03,15.51 0 top
U$1  87.5,33.47 0 top
U$2  92.72,114.5 90 top
U$3  26.26,100.65 0 bottom
U$4  11.25,20.77 270 top
U$5  65.04,85.19 90 top
U$6  32.98,80.1 0 top
U$7  64.99,100.96 90 top
U$9  70.49,124.86 180 top
U$10  4.06,120.45 270 top
USB_MODEM  5.15,34.14 270 top
X2*1775838-2  11.58,68.67 270 top

### Tracks (layer width: path | path; a pad name or v marks a point on that pad's centre or on a via)
3.3V
  Top 0.508: U$2.8 87.93,110.43 70.19,110.43 69.95,110.67 | C9.2 86.38,121.99 | 86.38,121.99 R8.1 | 86.38,121.99 86.43,122.03 C10.2 100.68,125.03 102.21,123.5 R6.1 102.22,123.48 R9.2 102.2,120.69 R10.2 102.22,118.12 102.22,115.7 | 102.22,115.7 102.27,115.75 R12.2 | 102.22,115.7 R11.2
  Top 1.27: U$1.1 57.6,34.4 56.7,35.3 56.7,36.96 54.56,39.1 54.56,45.57 61.46,52.47 66.92,52.47 69.05,54.59 69.05,109.77 69.95,110.67 78.5,119.22 R8.1
12  (via drill 0.4)
  Top 0.508: U$2.4 99.28,120.35 R9.1 99.13,120.86 v97.61,120.86 | A/V3.3 121.49,113.21 116.76,117.94 111.64,117.94 v108.7,120.88
  Bottom 0.508: v108.7,120.88 97.63,120.88 v97.61,120.86
14
  Top 0.508: U$2.1 99.04,112.59 R12.1 99.32,111.85 100.1,111.07 117.42,111.07 119.49,109 A/V3.4
15  (via drill 0.4)
  Top 0.406: U$2.3 U$2.2
  Top 0.508: U$2.2 97.43,113.86 R11.1 99.25,115.68 R10.1 | U$2.3 92.83,115.13 v92.8,115.16
  Bottom 0.508: v92.8,115.16 114.31,115.16 118.07,111.4 118.07,43.73 117,42.67 72.69,42.67 71.67,41.64 U$1.12
A  (via drill 0.4)
  Top 0.508: R7.1 86.7,113.8 | 86.7,113.8 R1.2 | U$2.7 86.76,113.86 86.7,113.8
  Top 0.813: A/B-RS485-2.4 119.48,93.48 A/B-RS485.4 119.5,97.74 121.36,99.6 123.49,99.6 | A/B-RS485-2.2 123.48,93.48 123.49,93.48 | 123.49,93.48 A/B-RS485.2 | A/V3.2 123.49,99.6 | 123.49,99.6 123.49,93.48 | v85.57,111.68 85.57,112.33 R1.2
  Bottom 0.813: A/V3.2 123.49,111.37 118.25,116.61 87.27,116.61 85.57,114.91 v85.57,111.68
B  (via drill 0.4)
  Top 0.508: R7.2 83.75,116.41 R8.2 87.28,119.22 87.83,118.67 87.83,115.93 88.63,115.13 U$2.6
  Top 0.813: A/B-RS485.3 121.48,93.48 A/B-RS485-2.3 121.48,84.28 121.92,83.85 124.78,83.85 125.48,84.55 A/B-RS485-2.1 125.5,86.39 A/B-RS485.1 125.49,93.51 A/V3.1 | v89.58,118.92 86.87,118.92 R8.2
  Bottom 0.813: A/V3.1 125.49,114.12 119.67,119.94 114.8,119.94 113.65,118.79 111.24,118.79 111.11,118.92 v89.58,118.92
GND  (via drill 0.4)
  Top 0.25: v80.32,31.72 v80.33,31.73 80.33,32.59 80.66,32.93 80.66,35.87 80.66,36.2 81.4,36.94 U$1.20
  Top 0.254: 80.66,35.87 80.44,35.65 64.1,35.65 64.05,35.7 U$1.6
  Top 0.406: 93.41,6.21 96.02,6.21 96.38,6.57 96.38,11.33 97.15,12.1 | 97.15,12.1 T2.2 | 97.15,12.1 97.93,12.88 99.36,12.88 v100.68,14.2 | v115,14.81 114.6,14.41 T3.2 | v124.88,13.35 121.74,16.48 R5.2 121.74,16.54 125.42,12.86 125.42,7.93 122.85,5.36 122.85,3.44 R2.2 | X2*1775838-2.4 11.16,66.77 9.16,64.77 X2*1775838-2.9 5.74,64.77 5.16,64.19 5.16,62.9 5.69,62.37 X2*1775838-2.15 9.38,60.47 9.38,56.35 12.29,53.45 13.47,53.45 | X2*1775838-2.50 17.41,45.17 18.03,45.8 18.03,51.09 | 18.03,51.09 17.55,51.57 X2*1775838-2.34 13.91,51.57 13.47,52 13.47,53.45 | 18.03,51.09 18.03,56.83 17.72,57.13 | 17.72,57.13 16.88,57.97 X2*1775838-2.18 15.68,59.69 v15.63,59.74 | IC4.1 18.96,58.37 17.72,57.13 | 13.47,53.45 13.47,54.46 13.79,54.77 X2*1775838-2.26
  Top 0.508: 74.77,10.66 IC2.5 78.07,13.23 78.52,13.68 79.99,13.68 | C1.C 88.46,7.59 89.16,8.29 IC1.7 89.16,12.57 89.54,12.95 | 89.54,12.95 90.75,12.95 92.16,11.54 92.16,7.42 93.37,6.21 93.41,6.21 | 79.99,13.68 79.94,13.73 80.01,13.8 86.14,13.8 86.62,13.32 | 79.99,13.68 80.61,13.06 IC2.7 | 89.54,12.95 86.99,12.95 86.62,13.32 | T1.2 72.3,7.86 71.43,6.99 65.1,6.99 60.27,11.82 PS1.5 | GPS_SERIAL1.1 107.56,24.06 110.97,20.65 110.97,17.97 108.54,15.54 v108.54,12.06 | IC1.5 86.62,13.32
  Top 0.61: R1.1 82.3,113.45 v82.26,113.42 | v89.77,122.69 LED1.C 91.92,122.26 91.92,118.22 U$2.5 | C9.1 81.49,122.03 v81.47,122.01
  Top 0.813: v81.47,122.01 78.34,122.01 U$9.1 75.49,121.84 v70.51,116.85 | U$7.1 57.01,95.96 46.97,106 v46.97,106.1 | U$3.P5 12.5,110.55 11.08,111.96 3.54,111.96 1.71,113.8 1.71,124.06 3.1,125.45 U$10.1
  Top 1.016: T1.2 73.58,11.85 74.77,10.66 76.78,8.65 R3.2 | C6.C 56.1,23.81 v56.1,23.88 | v42.54,24.81 44.55,24.81 J2.C5
  Bottom 0.508: v100.68,14.2 101.49,14.2 107.22,8.46 107.22,4.96 | 107.22,4.96 107.22,2.17 108.03,1.36 111.09,1.36 115,5.26 v115,14.81 | v108.54,12.06 108.54,6.28 107.22,4.96
  Bottom 0.813: v82.26,113.42 81.47,114.21 v81.47,122.01 | v46.97,106.1 46.99,106.12 61.01,106.12 63.06,108.17 67.05,108.17 68.4,109.51 68.4,115.61 69.64,116.85 v70.51,116.85
  Bottom 1.016: v56.1,23.88 43.47,23.88 v42.54,24.81
  pour Bottom (isolate 1.016): 1.6,127.29 1.6,1.14 2.22,0.52 126.66,0.52 126.66,127.29
  pour Top (isolate 1.016): 0.86,127.01 126.52,127.01 126.52,0.27 0.86,0.27
GND-CAR
  Top 1.016: R21.2 67.57,29.25 67.4,29.09 | R19.2 69.83,29.1 69.84,29.09 | R26.2 85.48,23.68 R18.1 87.89,23.61 R20.1
  Top 2: C3.1 51.16,10.55 C5.C 49.24,11.88 C2.- | PS1.2 15.09,16.6 22.8,8.89 38.64,8.89 C2.- | 9-36IN2.P$1 13.02,77.78 13.02,82.53 12.24,83.32 12.24,88.6 C4.- 11.3,93.22 12.81,94.74 23.62,94.74 25.63,92.73 40.13,92.73 42.79,95.38 42.79,99.59 39.43,102.95 U$3.P1 | R4.2 79.95,23.69 R25.1 | R4.2 82.75,23.71 R27.1 82.82,23.76 R26.2 | R4.2 79.98,26.08 76.97,29.09 69.84,29.09 67.4,29.09 56.17,29.09 41.63,14.55 C2.-
  Bottom 2: PS1.2 18.57,16.6 21.49,19.52 21.49,68.39 13.66,76.21 13.66,77.15 9-36IN2.P$1
GPIO1
  Top 1.016: T1.3 73.23,15.93 CON12V.1
GPIO2
  Top 1.016: T3.3 114.09,18.68 GPS.1
GPIO16
  Top 1.016: T2.3 99.26,18.73 MODEM.1
I/O-1  (via drill 0.4)
  Top 0.508: IC2.6 79.34,9.05 | 79.34,9.05 79.34,5.68 R24.2 | 79.34,9.05 80.14,8.24 v80.43,8.24 | v91.49,19.41 91.49,14.08 v92.61,12.95
  Bottom 0.508: v80.43,8.24 81.15,8.96 96.15,8.96 101.57,3.54 103.31,3.54 104.31,4.54 104.31,6.81 98.45,12.67 92.89,12.67 v92.61,12.95 | v91.49,19.41 97.07,25 97.07,27.74
  Bottom 0.61: 97.07,27.74 U$1.31
I/O-2  (via drill 0.4)
  Top 0.508: IC2.8 81.88,8 | 81.88,8 81.88,5.61 R22.2 | 81.88,8 82.63,7.25 v82.63,7.04 | v93.61,14.28 92.55,15.34 92.55,22.73
  Top 0.61: U$1.23 86.91,31.66 92.55,26.01 92.55,22.73
  Bottom 0.508: v82.63,7.04 94.7,7.04 99.32,2.41 103.94,2.41 105.8,4.28 105.8,7.32 98.95,14.17 93.61,14.17 v93.61,14.28
I/O-3
  Top 0.508: IC1.6 87.89,9.3 85.46,6.87 R17.2
I/O-4
  Top 0.508: IC1.8 90.43,6.79 R16.2
IO1-CON  (via drill 0.4)
  Top 0.508: IC2.1 85.23,19.25 v85.23,19.66 85.4,19.83 R26.1
  Bottom 0.508: A/V1.4 78.27,26.62 v85.23,19.66
IO2-CON  (via drill 0.4)
  Top 0.508: IC2.3 v79.34,19.64 79.34,20.13 R4.1
  Bottom 0.508: v79.34,19.64 79.11,19.64 72.78,25.97 A/V1.3
IO3-CON  (via drill 0.4)
  Top 0.508: v90.48,18.21 90.48,16.07 IC1.1 | R19.1 77.43,31.59 v78.91,30.11
  Bottom 0.508: v90.48,18.21 90.07,18.63 78.05,18.63 70.78,25.9 A/V1.2 73,28.85 77.65,28.85 v78.91,30.11
IO4-CON  (via drill 0.4)
  Top 0.508: v87.85,17.67 87.89,17.63 IC1.3
  Top 1.016: R21.1 62.87,31.64 v62.87,31.62 | v62.94,26.93 63.56,26.31 68.46,26.31 A/V1.1
  Bottom 0.508: A/V1.1 68.78,26.01 77.18,17.61 87.79,17.61 v87.85,17.67
  Bottom 1.016: v62.87,31.62 62.87,27 v62.94,26.93
N$2
  Top 0.508: R6.2 98.63,122.69 LED1.A
N$3
  Top 1.016: LED2.C 124.58,2.37 R2.1
N$4
  Top 1.016: LED3.C 69.89,2.8 R3.1
N$5
  Top 1.016: LED4.C 124.57,17.21 R5.1
N$6
  Top 1.016: R13.2 94.57,12.79 T2.1
N$7
  Top 0.508: IC2.2 80.61,17.68 82.76,19.83 R27.2
N$8
  Top 1.016: T1.1 69.71,11.16 R14.2
N$9
  Top 0.508: IC2.4 77.24,16.72 R25.2
N$10
  Top 1.016: T3.1 111.29,14.2 R15.2
N$11
  Top 0.508: R20.2 89.16,19.64 IC1.2
N$15
  Top 0.508: R18.2 86.62,19.54 IC1.4
PW-SWITCH-1-GP3
  Top 1.27: U$1.33 99.61,29.99 107.12,22.48 107.12,11.08 108.69,9.5 113.43,9.5 114.69,10.76 R15.1
PW-SWITCH-1-GP6
  Top 1.27: R13.1 101.01,9.2 105.07,13.26 105.07,20.83 94.61,31.29 94.61,34.32 U$1.29
PW-SWITCH-1-GP7  (via drill 0.4)
  Top 0.813: R14.1 67.36,10.17 67.36,15.06 v67.4,15.1
  Bottom 0.813: v67.4,15.1 67.44,15.1 67.44,23.6 64.86,26.19 64.86,28.47 67.55,31.16 76.75,31.16 U$1.15
RX1+
  Bottom 1.27: U$6.RX1+ 38.99,80.96 55.99,97.96 U$7.2
RX1-
  Bottom 1.27: U$6.RX1- 36.45,82.41 54,99.96 U$7.3
RX2+
  Top 1.27: U$6.RX2+ 62.06,80.1 64.15,82.19 U$5.2
RX2-
  Top 1.27: U$6.RX2- 50.95,81.22 52.69,82.95 60.68,82.95 61.9,84.18 U$5.3
RX3+
  Top 1.27: A/V2.1 64.68,108.49 U$6.RX3+
RX3-
  Top 1.27: A/V2.2 66.18,112 62.38,112 61.41,111.03 U$6.RX3-
RX4+
  Bottom 1.27: U$6.RX4+ 44.37,120.63 46.38,118.63 70.53,118.63 73.49,121.59 U$9.2
RX4-
  Top 0.813: U$6.RX4- 46.91,119.6 49.73,116.78 54.74,116.78 56.54,118.58 67.98,118.58 71.49,122.1 U$9.3
RX5+
  Bottom 1.016: U$6.RX5+ 10.88,124.7 9.59,123.41 4.1,123.41 U$10.2
RX5-
  Bottom 1.016: U$6.RX5- 32.51,123.62 32.48,123.58 32.48,122.09 27.2,116.81 22.93,116.81 18.3,121.45 U$10.3
SIM-CLK-M1  (via drill 0.4)
  Top 0.406: X2*1775838-2.12 12.82,63.57
  Top 0.508: v12,57.42 12,57.8 12.01,57.8 12.01,62.76 12.82,63.57 | v13.12,29.33 16.6,29.33 17.13,29.85 19.37,29.85 J2.C3
  Bottom 0.508: v12,57.42 12,56.5 12.02,45.22 12.98,44.25 12.98,29.47 v13.12,29.33
SIM-IO-M1  (via drill 0.4)
  Top 0.406: X2*1775838-2.10 30.43,64.37
  Top 0.508: 30.43,64.37 v30.45,64.35 | v49.46,29.74 44.7,29.74 J2.C7
  Bottom 0.508: v30.45,64.35 50.55,64.35 51.77,63.13 51.77,37.77 50.8,36.8 50.8,31.08 v49.46,29.74
SIM-RST-M1  (via drill 0.4)
  Top 0.508: X2*1775838-2.14 13.87,62.77 13.43,62.33 v13.43,57.5 | v15.43,27.17 15.54,27.28 J2.C2
  Bottom 0.508: v13.43,57.5 15.42,55.51 15.42,27.18 v15.43,27.17
SIM-VCC-M1  (via drill 0.4)
  Top 0.406: X2*1775838-2.8 11.63,65.17
  Top 0.508: v10.49,57.4 10.49,64.03 11.63,65.17 | v13.98,24.91 19.23,24.91 J2.C1
  Bottom 0.508: v10.49,57.4 10.12,57.03 10.12,28.7 13.94,24.88 v13.98,24.91
SIM-VPP-M1  (via drill 0.4)
  Top 0.406: X2*1775838-2.16 30.31,61.97
  Top 0.508: 30.31,61.97 v30.33,61.96 | v48.15,27.29 48.14,27.28 J2.C6
  Bottom 0.508: v30.33,61.96 44.27,61.96 48.15,58.08 v48.15,27.29
TX1+
  Bottom 1.27: U$6.TX1+ 33.91,83.77 52.1,101.96 U$7.4
TX1-
  Bottom 1.27: U$6.TX1- 31.37,85.57 49.76,103.96 U$7.5
TX2+
  Bottom 1.27: U$6.TX2+ 48.41,77.53 49.5,76.44 65.38,76.44 67.35,78.41 67.35,85.8 66.93,86.21 65.06,86.21 U$5.4
TX2-
  Bottom 1.27: U$6.TX2- 45.87,81.47 48.45,84.05 59.9,84.05 64.05,88.19 65.03,88.19 U$5.5
TX3+
  Top 1.27: U$6.TX3+ 59.86,113.57 60.34,114.06 A/V2.3
TX3-
  Top 1.27: A/V2.4 66.19,116.11 U$6.TX3-
TX4+
  Top 0.813: U$6.TX4+ 49.45,119.82 49.5,119.87 51.33,118.03 54.29,118.03 56.9,120.65 65.77,120.65 69.49,124.37 U$9.4
TX4-
  Top 0.813: U$6.TX4- 53.83,126.54 65.97,126.54 67.49,125.02 U$9.5
TX5+
  Bottom 1.016: U$6.TX5+ 35.1,124.65 35.1,122.17 27.52,114.59 22.08,114.59 17.22,119.45 U$10.4
TX5-
  Bottom 1.016: U$10.5 14.63,117.45 21.47,110.61 26.41,110.61 37.59,121.79 U$6.TX5-
UART1-RX
  Top 0.813: GPS_SERIAL1.3 111.56,30.92 110.05,32.43 110.05,39.04 109.55,39.54 70.63,39.54 69.13,38.04 U$1.10
UART1-TX  (via drill 0.4)
  Top 0.813: v73.56,41.13 73.52,41.09 68.98,41.09 66.47,38.58 66.47,37.06 U$1.8
  Bottom 0.813: GPS_SERIAL1.2 110.01,26.09 110.01,37.57 106.41,41.17 73.59,41.17 v73.56,41.13
USB_DM3
  Top 0.406: X2*1775838-2.36 11.69,50.77
  Top 0.508: 11.69,50.77 9.84,48.92 9.84,44.55 8.75,43.47 6.44,43.47 3.07,40.1 3.07,36.33 4.26,35.14 USB_MODEM.2
USB_DP3
  Top 0.508: X2*1775838-2.38 13.59,49.97 12.43,48.81 12.43,45.43 13.12,44.74 13.12,39.01 7.22,33.12 5.18,33.12 USB_MODEM.3
VCC  (via drill 0.4)
  Top 1.016: v69.85,15.7 66.73,18.83 65.86,18.83 CON12V.4
  Top 1.27: U$6.DC+ 17.17,89.53 U$3.P3 20.08,86.63 20.08,79.21 27.91,71.38 41.17,71.38 45.04,67.5 45.04,44.48 42.86,42.3 C8.A
  Bottom 0.813: U$1.2 55.93,33.9 55.93,29.92 58.45,27.41 60.14,27.41 64.18,23.37 64.18,20.06 CON12V.4 | GPS.3 109.65,3.6 109.65,18.53 GPS.4 107.01,16.2 97.57,16.2 MODEM.4
  Bottom 1.016: 97.57,16.2 97.08,15.7 v69.85,15.7
  Bottom 1.27: U$3.P3 25.86,80.84 25.86,78.14 32.74,71.26 52.15,71.26 58.97,64.45 U$1.2
VCC12  (via drill 0.4)
  Top 1.016: v52.78,30.91 49.73,33.97 49.73,46.11 59.54,55.93 v66.77,55.93 | U$10.6 42.73,115.45 52.29,105.89 64.92,105.89 U$7.6
  Top 2: PS1.6 60.27,21.71 54.48,15.92 C6.A 52.93,15.92 65.49,3.37 CON12V.3
  Bottom 0.813: U$9.6 67.15,126.52 76.8,126.52 78.34,124.98 78.34,121.76 69.84,113.26 69.84,107.94 69.48,107.58 | 69.48,107.58 67.85,105.96 U$7.6 | U$5.6 69.48,94.63 | 69.48,94.63 69.48,107.58 | v66.77,55.93 69.48,58.63 69.48,94.63
  Bottom 1.016: PS1.6 58.92,25.56 54.76,25.56 52.78,27.54 v52.78,30.91
VCC12.1
  Top 1.016: LED3.A 69.49,5.91 CON12V.2
  Bottom 2: U$4.P$1 U$4.P$2 9.95,16.27 23.54,2.68 50.48,2.68 54.42,6.62 72.52,6.62 CON12V.2
VCC-3.3V-M1  (via drill 0.4)
  Top 0.406: X2*1775838-2.2 29.53,67.57 | X2*1775838-2.52 24.54,44.37
  Top 0.508: D2.A 31.95,51.79 24.54,44.37 | R24.1 81.93,2.69 | 81.93,2.69 82.71,2.69 83.09,2.3 83.84,2.3 | 81.93,2.69 R22.1 | 83.84,2.3 R17.1 85.6,2.44 88.13,2.44 | C1.A 88.13,2.44 | R16.1 88.31,2.62 88.13,2.44 | 83.84,2.3 83.77,2.36 v83.77,12.78
  Top 0.61: IC4.2 37.68,61.49 36.77,62.4 34.7,62.4 29.53,67.57
  Top 0.813: 24.54,44.37 38.38,30.53 38.38,23.79 39.99,22.18 v43.79,22.18
  Top 1.27: IC4.2 37.68,54.27 D2.A
  Bottom 0.813: v43.79,22.18 56.83,22.18 65.69,13.32 83.24,13.32 v83.77,12.78
VCC-CAR  (via drill 0.4)
  Top 2: v27.89,6.27 27.89,4.49 L1.2 28.38,4 C2.+ 50.84,4 | C3.2 54.71,5.89 52.83,4 50.84,4 | C5.A 50.86,4.03 50.84,4 | 9-36IN2.P$4 10.14,78.6 3.42,85.32 C4.+ 3.42,96.37 L2.2
  Bottom 2: v27.89,6.27 25.8,8.36 25.8,71.39 15.38,81.81 11.85,81.81 10.14,80.09 9-36IN2.P$4
VCC-IN  (via drill 0.4)
  Top 1.016: MODEM.2 102.78,5.89 110.6,5.89 114.14,2.35 117.7,2.35 119.74,4.4 119.74,4.5 120.66,4.5 LED2.A
  Top 1.27: IC4.3 39.99,51.8 D2.C 39.19,50.98 C7.A 41.45,47.03 v41.52,47.1
  Bottom 1.016: MODEM.2 101.67,6.03 96.54,11.17 47.2,11.17
  Bottom 1.27: 47.2,11.17 38.08,20.28 38.08,43.67 v41.52,47.1
VCC-M1  (via drill 0.4)
  Top 1.27: USB_MODEM.4 15.79,31.14 17.87,33.23 27.19,33.23 v32.56,27.85
  Bottom 0.508: 32.55,27.68 32.55,27.83 v32.56,27.85
  Bottom 1.016: MODEM.3 80.62,3.49 74.86,9.25 39.28,9.25
  Bottom 1.27: 32.55,27.68 32.55,15.99 39.28,9.25
VCC-M2
  Top 1.016: GPS_SERIAL1.4 115.92,25.64 LED4.A
  Bottom 0.813: GPS_SERIAL1.4 113.56,18.66 116.99,15.24 116.99,6.09 GPS.2
VIN2
  Top 2: L1.1 22.36,19.07 17.16,19.07 PS1.1
VIN3
  Top 2: U$3.P2 28.09,97.85 20.9,105.03 10.03,105.03 7.31,107.75 L2.1

### Text on the board
tPlace: SERIAL1
tNames: RJ45-5 | RJ45-4 | RJ45-3 | RS-485 | RJ45-1 | RS-485 | RJ45-2 | BAT | CON-MODEM | I/O CAR | GPS | OUT-12V